# Altium schematic sheet MCU.SchDoc
size A4
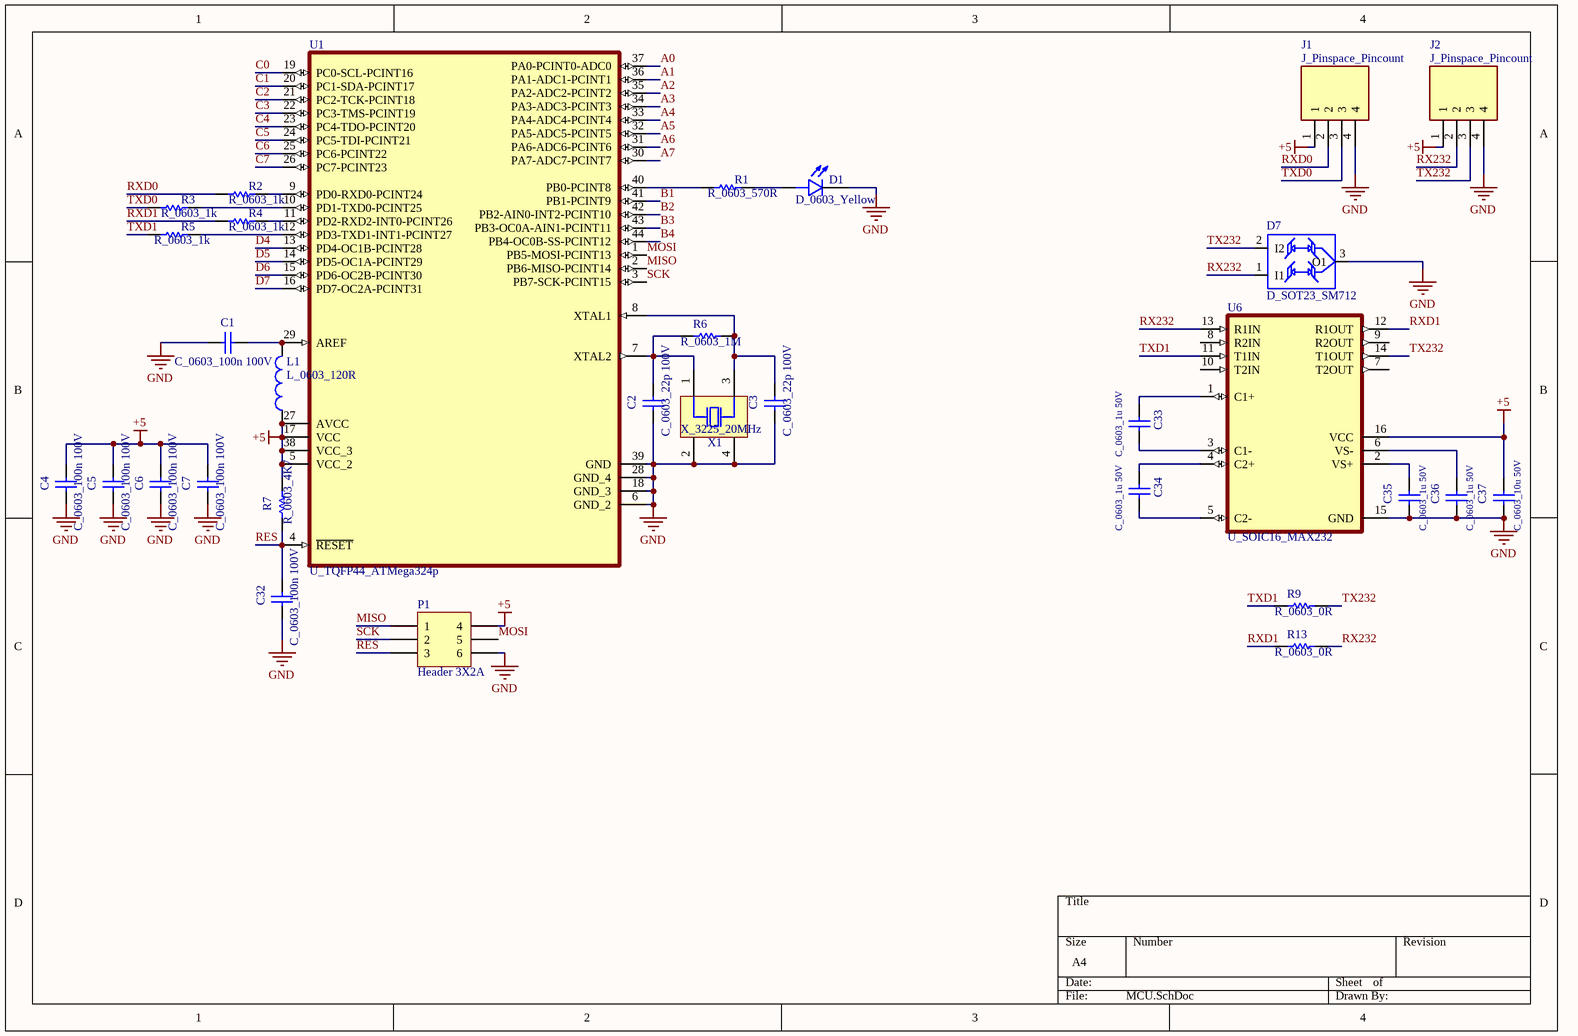
[diagram p0: MCU.SchDoc]

## Parts
C1  C_0603_100n 100V  [CAP 0603]
C2  C_0603_22p 100V  [CAP 0603]
C3  C_0603_22p 100V  [CAP 0603]
C4  C_0603_100n 100V  [CAP 0603]
C5  C_0603_100n 100V  [CAP 0603]
C6  C_0603_100n 100V  [CAP 0603]
C7  C_0603_100n 100V  [CAP 0603]
C32  C_0603_100n 100V  [CAP 0603]
C33  C_0603_1u 50V  [CAP 0603]
C34  C_0603_1u 50V  [CAP 0603]
C35  C_0603_1u 50V  [CAP 0603]
C36  C_0603_1u 50V  [CAP 0603]
C37  C_0603_10u 50V  [CAP 0603]
D1  D_0603_Yellow  [Led 0603]
D7  D_SOT23_SM712  [SOT23]
J1  J_Pinspace_Pincount  [4 Pin PCB STB 5.08]
J2  J_Pinspace_Pincount  [4 Pin PCB STB 5.08]
L1  L_0603_120R  [Inductor 0603]
P1  Header 3X2A  [HDR2X3_CEN]
R1  R_0603_570R  [RES 0603]
R2  R_0603_1k  [RES 0603]
R3  R_0603_1k  [RES 0603]
R4  R_0603_1k  [RES 0603]
R5  R_0603_1k  [RES 0603]
R6  R_0603_1M  [RES 0603]
R7  R_0603_4K7  [RES 0603]
R9  R_0603_0R  [RES 0603]
R13  R_0603_0R  [RES 0603]
U1  U_TQFP44_ATMega324p  [TQFP44]
U6  U_SOIC16_MAX232  [SOIC16]
X1  X_3225_20MHz  [Crystal 3.2x2.5]

## Nets
+5: C4.2 C5.2 C6.2 C7.2 C37.2 J1.1 J2.1 L1.1 P1.4 R7.2 U1.5(VCC_2) U1.17(VCC) U1.27(AVCC) U1.38(VCC_3) U6.16(VCC)
GND: C1.1 C2.2 C3.2 C4.1 C5.1 C6.1 C7.1 C32.1 C35.1 C36.1 C37.1 D1.2(C) D7.3(O1) J1.4 J2.4 P1.6 U1.6(GND_2) U1.18(GND_3) U1.28(GND_4) U1.39(GND) U6.15(GND) X1.2(NC) X1.4(NC)
A0: U1.37(PA0-PCINT0-ADC0)
A1: U1.36(PA1-ADC1-PCINT1)
A2: U1.35(PA2-ADC2-PCINT2)
A3: U1.34(PA3-ADC3-PCINT3)
A4: U1.33(PA4-ADC4-PCINT4)
A5: U1.32(PA5-ADC5-PCINT5)
A6: U1.31(PA6-ADC6-PCINT6)
A7: U1.30(PA7-ADC7-PCINT7)
B1: U1.41(PB1-PCINT9)
B2: U1.42(PB2-AIN0-INT2-PCINT10)
B3: U1.43(PB3-OC0A-AIN1-PCINT11)
B4: U1.44(PB4-OC0B-SS-PCINT12)
C0: U1.19(PC0-SCL-PCINT16)
C1: U1.20(PC1-SDA-PCINT17)
C2: U1.21(PC2-TCK-PCINT18)
C3: U1.22(PC3-TMS-PCINT19)
C4: U1.23(PC4-TDO-PCINT20)
C5: U1.24(PC5-TDI-PCINT21)
C6: U1.25(PC6-PCINT22)
C7: U1.26(PC7-PCINT23)
D4: U1.13(PD4-OC1B-PCINT28)
D5: U1.14(PD5-OC1A-PCINT29)
D6: U1.15(PD6-OC2B-PCINT30)
D7: U1.16(PD7-OC2A-PCINT31)
MISO: P1.1 U1.2(PB6-MISO-PCINT14)
MOSI: P1.5 U1.1(PB5-MOSI-PCINT13)
RES: C32.2 P1.3 R7.1 U1.4(~{RESET})
RX232: D7.1(I1) J2.2 R13.2 U6.13(R1IN)
RXD0: J1.2 R2.2
RXD1: R4.2 R13.1 U6.12(R1OUT)
SCK: P1.2 U1.3(PB7-SCK-PCINT15)
TX232: D7.2(I2) J2.3 R9.2 U6.14(T1OUT)
TXD0: J1.3 R3.2
TXD1: R5.2 R9.1 U6.11(T1IN)
NetC1_2: C1.2 L1.2 U1.29(AREF)
NetC2_1: C2.1 R6.1 U1.7(XTAL2) X1.1(OSC1)
NetC3_1: C3.1 R6.2 U1.8(XTAL1) X1.3(OSC2)
NetC33_1: C33.1 U6.1(C1+)
NetC33_2: C33.2 U6.3(C1-)
NetC34_1: C34.1 U6.4(C2+)
NetC34_2: C34.2 U6.5(C2-)
NetC35_2: C35.2 U6.2(VS+)
NetC36_2: C36.2 U6.6(VS-)
NetD1_1: D1.1(A) R1.1
NetR1_2: R1.2 U1.40(PB0-PCINT8)
NetR2_1: R2.1 U1.9(PD0-RXD0-PCINT24)
NetR3_1: R3.1 U1.10(PD1-TXD0-PCINT25)
NetR4_1: R4.1 U1.11(PD2-RXD2-INT0-PCINT26)
NetR5_1: R5.1 U1.12(PD3-TXD1-INT1-PCINT27)

Not connected (* = marked no-connect by the designer): U6 7(T2OUT) 8(R2IN) 9(R2OUT) 10(T2IN)

## Library data of the parts
C1-C7 C32-C37 = Cap: Capacitor; Published: 8-Jun-2000; LatestRevisionDate: 17-Jul-2002; LatestRevisionNote: Re-released for DXP Platform.; Publisher: Altium Limited
D1 = Led: MP: SML-D12FWT86; MF: Rohm; Price: None; Availability: In Stock; Package: 0603 Rohm; SnapEDA_Link: https://www.snapeda.com/parts/SML-D12FWT86/Rohm/view-part/?ref=snap; Check_prices: https://www.snapeda.com/parts/SML-D12FWT86/Rohm/view-part/?ref=eda; Value: *; Purchase-URL: https://pricing.snapeda.com/search/part/SML-D12FWT86/?ref=eda
D7 = DIODE TVS ARRAY: TVS Diode Array; MP: SM712; MF: Semtech; Price: None; SnapEDA_Link: https://www.snapeda.com/parts/SM712/Semtech/view-part/4219095/?ref=snap; Availability: Unavailable; Value: *; Package: SOT-23 Semtech
J1 J2 = 4 Pin PCB Terminal Block: MP: TBP02R1-381-04BE; Availability: Unavailable; Package: None; Price: None; Value: *
L1 = Inductor: PCB_Layout: Complies with manufacturer's recommendation.; Published: 26-Sep-2008; DatasheetVersion: Mar-2008; PackageVersion: Mar-2008; PackageReference: B82462G4; Publisher: Altium Limited; PackageDescription: SM Power Inductor; 2 Leads; Body 6.3 x 6.3 x 3.0 mm (LxWxH); ComponentLink1Description: Manufacturer Link; ComponentLink1URL: http://www.epcos.com/; ComponentLink2Description: Datasheet; ComponentLink2URL: http://www.epcos.com/inf/30/db/ind_2008/b82462g4.pdf
P1 = Header 3X2A: Header, 3-Pin, Dual row; LatestRevisionDate: 17-Jul-2002; LatestRevisionNote: Re-released for DXP Platform.; Publisher: Altium Limited
R1-R7 R9 R13 = Res: Resistor; Published: 8-Jun-2000; LatestRevisionDate: 17-Jul-2002; LatestRevisionNote: Re-released for DXP Platform.; Publisher: Altium Limited
U1 = ATMEGA324P-20AU: AVR AVRÂ® ATmega Microcontroller IC 8-Bit 20MHz 32KB _16K x 16_ FLASH 44-TQFP _10x10_; MF: Microchip; Availability: Unavailable; Package: TQFP-44 Microchip; Price: None; SnapEDA_Link: https://www.snapeda.com/parts/ATMEGA324P-20AU/Microchip/view-part/696895/?ref=snap; Value: *; MP: ATMEGA324P-20AU
U6 = MAX232DW: Dual EIA-232 driver and receiver 16-SOIC 0 to 70; MF: Texas Instruments; Price: None; SnapEDA_Link: https://www.snapeda.com/parts/MAX232DW/Texas%20Instruments/view-part/7702/?ref=snap; Purchase-URL: https://pricing.snapeda.com/search/part/MAX232DW/?ref=eda; Check_prices: https://www.snapeda.com/parts/MAX232DW/Texas%20Instruments/view-part/7702/?ref=eda; Value: *; MP: MAX232DW; Package: SOIC-16 Texas Instruments; Availability: Good
X1 = Crystal 4 Pin